# EAGLE design InputSwitch (EAGLE 6.1)
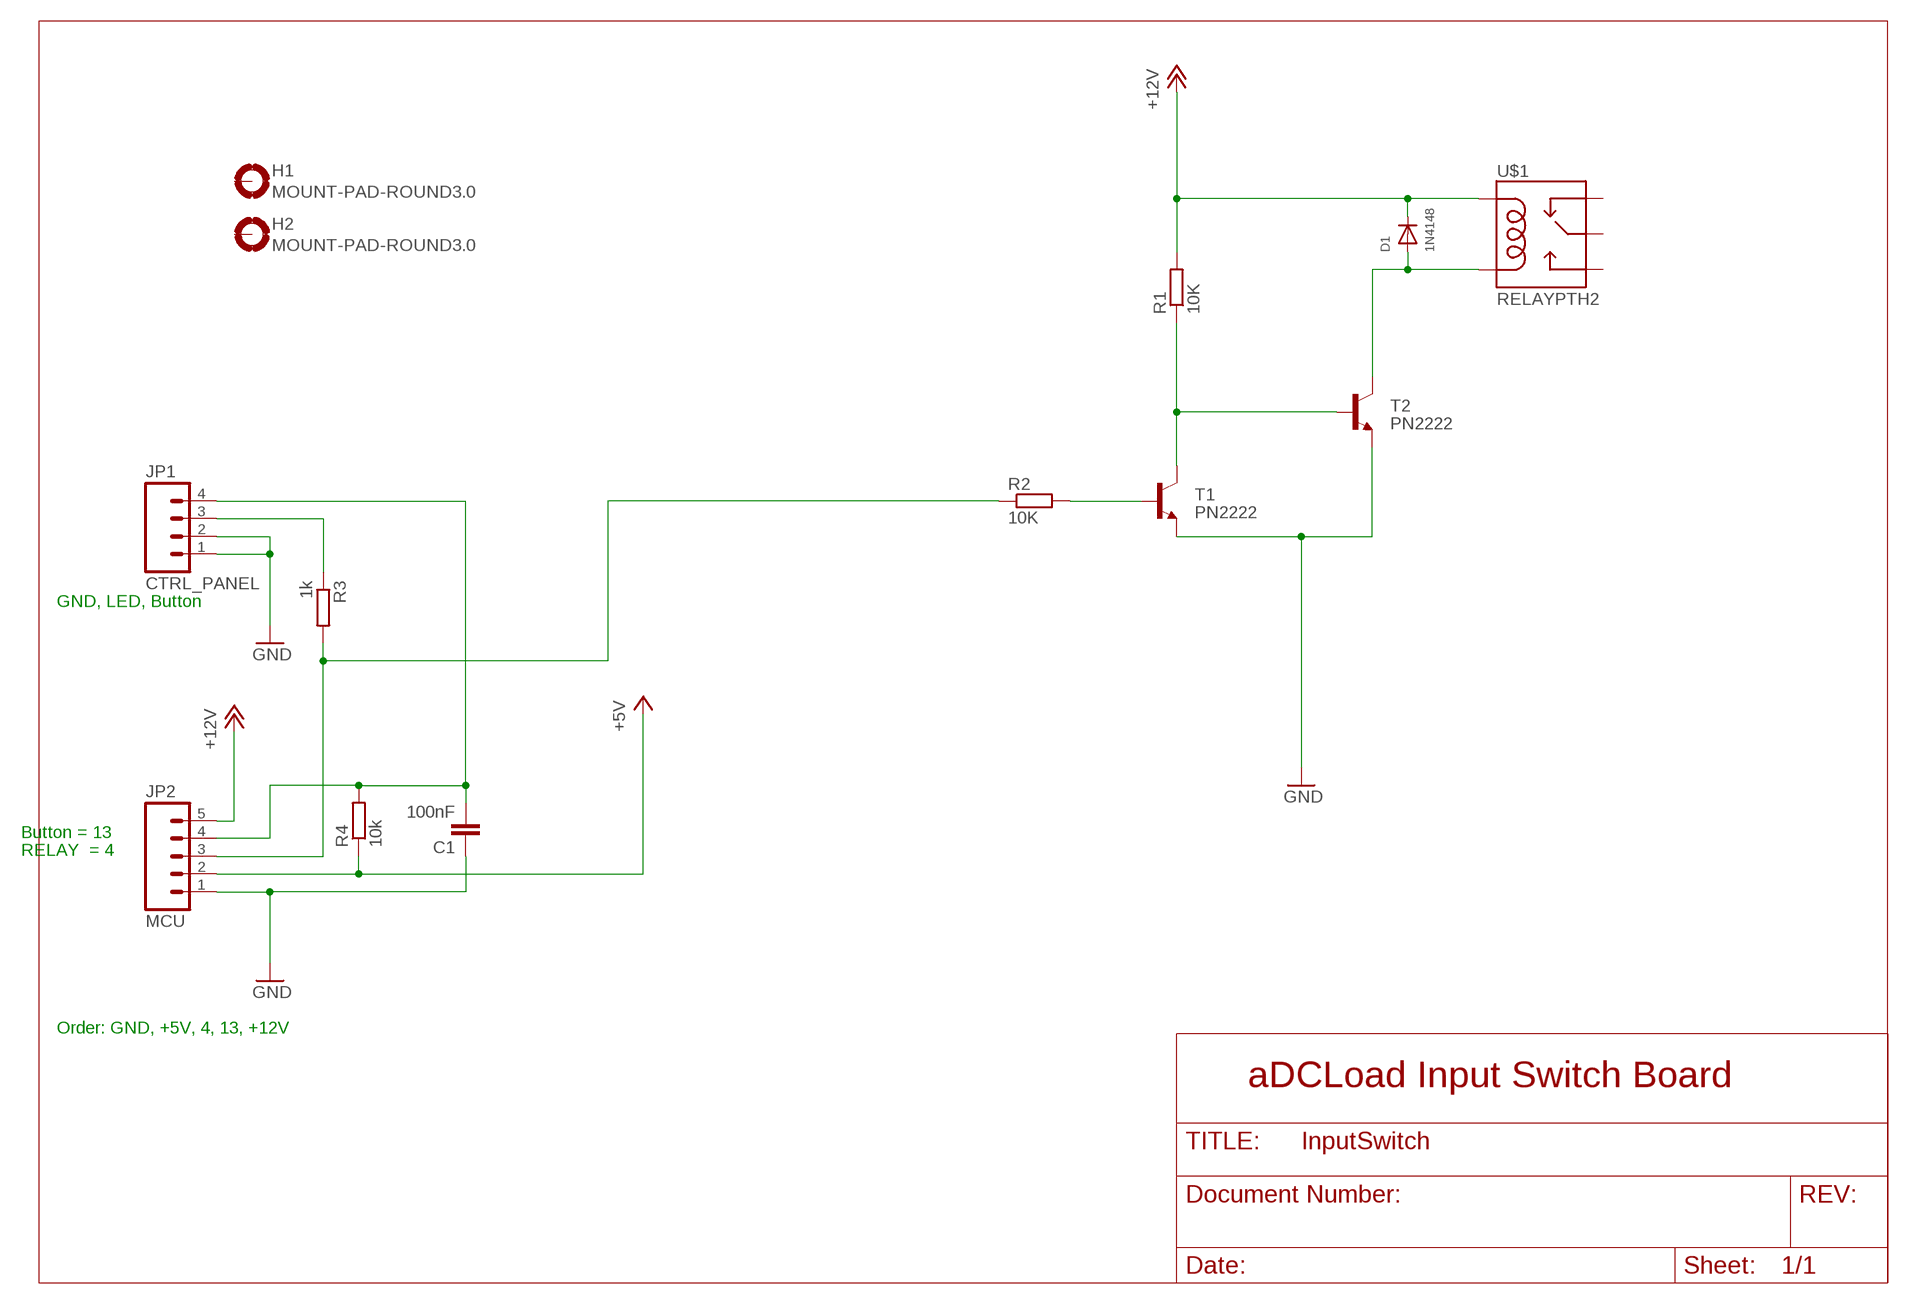
[diagram p0: schematic, sheet 1]

## Parts
C1  100nF  C-EUC0805  [C0805]
D1  1N4148  DIODESOD-123  [SOD-123]
H1  MOUNT-PAD-ROUND3.0  [3,0-PAD]
H2  MOUNT-PAD-ROUND3.0  [3,0-PAD]
JP1  CTRL_PANEL  M04PTH  [1X04]
JP2  MCU  M05PTH  [1X05]
R1  10K  R-EU_R0805  [R0805]
R2  10K  R-EU_R0805  [R0805]
R3  1k  R-EU_R0805  [R0805]
R4  10k  R-EU_R0805  [R0805]
T1  PN2222  TRANSISTOR_NPNMMBT2222A  [SOT23-3]
T2  PN2222  TRANSISTOR_NPNMMBT2222A  [SOT23-3]
U$1  RELAYPTH2  [RELAY-T9A]

## Nets
+5V: JP2.2 R4.1
+12V: D1.C JP2.5 R1.2 U$1.COIL1
BTN: C1.2 JP1.4 JP2.4 R4.2
GND: C1.1 JP1.1 JP1.2 JP2.1 T1.2(E) T2.2(E)
N$1: R2.2 T1.1(B)
N$2: R1.1 T1.3(C) T2.1(B)
N$4: D1.A T2.3(C) U$1.COIL2
N$6: JP2.3 R2.1 R3.2
RL_LED: JP1.3 R3.1
Unconnected: H1.B3,0(MOUNT) H2.B3,0(MOUNT) U$1.MAIN U$1.NC U$1.NO

## Notes on the sheet
- GND, LED, Button
- Button = 13
- RELAY  = 4
- Order: GND, +5V, 4, 13, +12V
- aDCLoad Input Switch Board

## Library data of the parts
C1 = resistor:C-EU: CAPACITOR, European symbol
D1 = adafruit:DIODE: Diode SMADIODE - SMA Surface Mount Package 20V 1A Schottky Diode Digikey: 641-1014-6-ND DO-1N4148 - Through Hole Small Current Diode SOD-123 20V 1 A (.5mV Vf) Schottky Diode - Digikey: MBRX120TPMSCT-ND SOD-323 10V 570mA (.38mV Vf, 3ns) Schottky Diode - Digikey: ZLLS410CT-ND SOD-523 30V 30mA Schottky Diode (RB751S-40TE61) - Digikey: RB751S-40TE61CT-ND SOT23-R/W - SOT23 Package (R = Solder Paste/Reflow Ovens, W = Hand-Soldering) BAT54Film 40V 300mA - Digikey: 497-7162-1-ND
H1 H2 = holes:MOUNT-PAD-ROUND: MOUNTING PAD, round
JP1 = SparkFun-Connectors:M04: Header 4 Standard 4-pin 0.1" header. Use with straight break away headers (SKU : PRT-00116), right angle break away headers (PRT-00553), swiss pins (PRT-00743), machine pins (PRT-00117), and female headers (PRT-00115). Molex polarized connector foot print use with SKU : PRT-08231 with associated crimp pins and housings. 1MM SMD Version SKU: PRT-10208
JP2 = SparkFun-Connectors:M05: Header 5 Standard 5-pin 0.1" header. Use with straight break away headers (SKU : PRT-00116), right angle break away headers (PRT-00553), swiss pins (PRT-00743), machine pins (PRT-00117), and female headers (PRT-00115). Molex polarized connector foot print use with SKU : PRT-08230 with associated crimp pins and housings.
R1-R4 = resistor:R-EU_: RESISTOR, European symbol
T1 T2 = SparkFun-DiscreteSemi:TRANSISTOR_NPN: Generic NPN BJT MMBT2222A - TRANS-08049 (SOT-23, 1A 40V) MPSA42 - TRANS-09116 (SOT-23, 500mA 300V) MMBT5088LT1G - TRANS-11160 (SOT-23, 50 mA 30V); PROD_ID: TRANS-08049; VALUE: MMBT2222A
U$1 = SparkFun-Electromechanical:RELAY: SPDT relay (COM-00101)

## Board
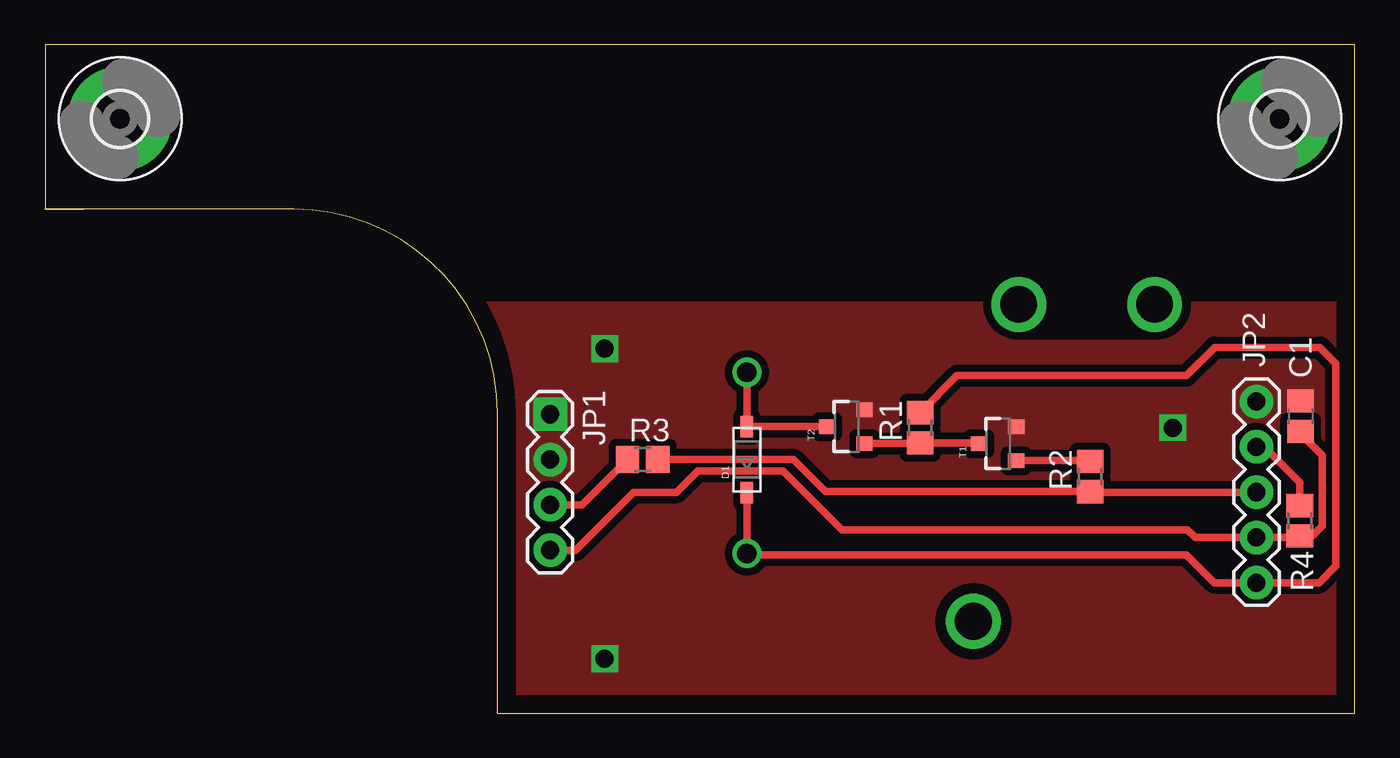
[diagram p1: board, top side]
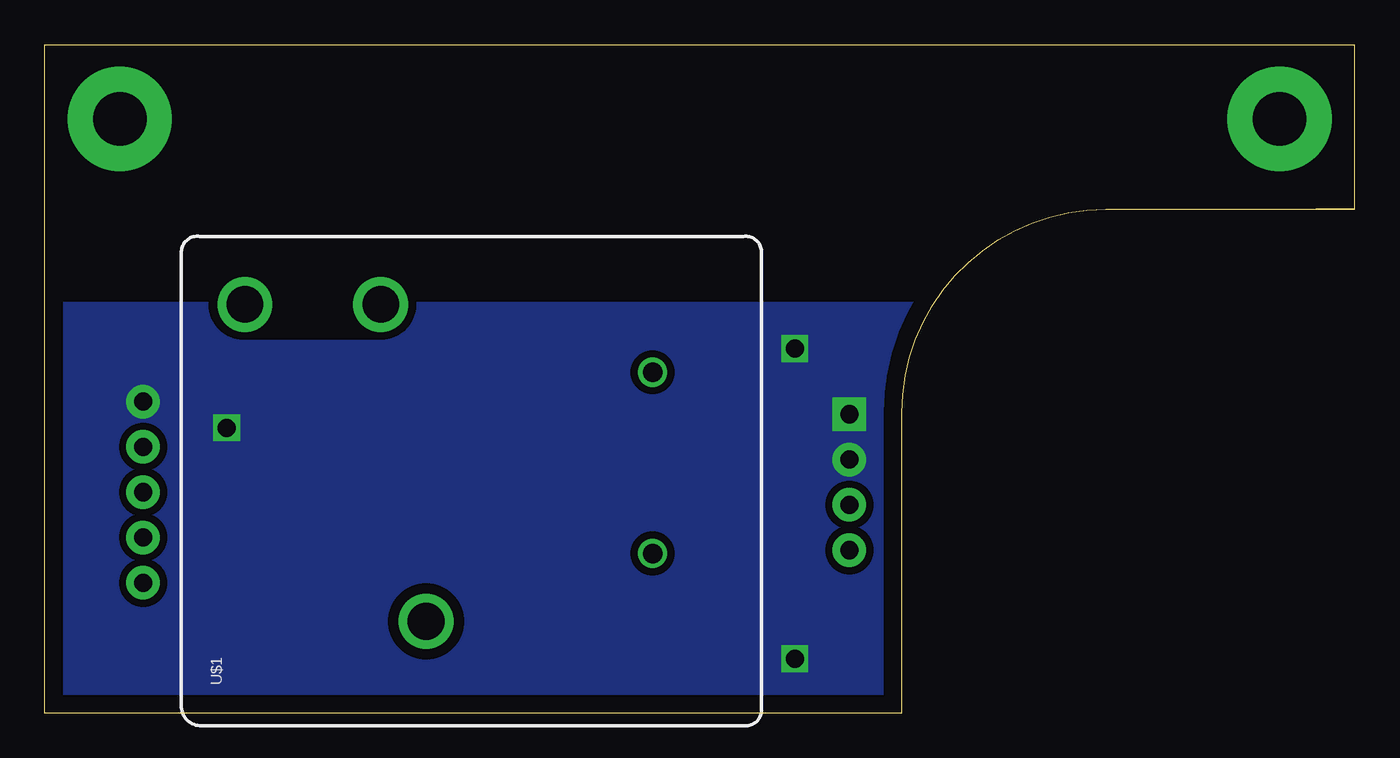
[diagram p2: board, bottom side, seen from below]

Size 73.46 x 37.49 mm. Coordinates in mm from the lower left corner, seen from the top.
Outline: 0,28.26 13.97,28.26 arc-90 25.4,16.83 25.4,0 73.46,0 73.46,37.49 0.02,37.49 0.02,28.26 2.19,28.26
Copper layers (1*16): Top 0.035mm / dielectric 1.5mm / Bottom 0.035mm
Design rules: minimum track width 10mil, minimum drill 24mil, track to track 8mil, track to pad 8mil, pad to pad 8mil, via to via 8mil, smd to smd 8mil, copper to edge 40mil, drill to drill 8mil, minimum pad ring 10mil, minimum via ring 8mil, stop-mask expansion 4mil, vias tented up to drill 0mil, thermal gap 10mil
tRestrict: area 0,23.5 to 73.5,37.5; area 50.3,3.4 to 53.8,6.9; area 53,21.3 to 63.9,23.5
bRestrict: area 0,23.5 to 73.4,37.5; area 50.3,3.4 to 53.8,6.9; area 53,21.3 to 63.9,23.5

### Footprints (pad centres in the part's own frame; a part is rotated, then mirrored left to right if it is on the bottom)
C0805 = smd 1.3 x 1.5: 1 -0.85,0; 2 0.85,0
SOD-123 = smd 1.2 x 0.7: A 1.85,0; C -1.85,0
3,0-PAD = drill 3 pad 5.842: B3,0 0,0
1X04 = drill 1.016 pad 1.88 square: 1 0,0 | drill 1.016 pad 1.88: 2 2.54,0; 3 5.08,0; 4 7.62,0
1X05 = drill 1.016 pad 1.88: 1 0,0; 2 2.54,0; 3 5.08,0; 4 7.62,0; 5 10.16,0
R0805 = smd 1.3 x 1.5: 1 -0.85,0; 2 0.85,0
SOT23-3 = smd 0.8 x 0.9: 1 -0.95,-1; 2 0.95,-1; 3 0,1.1
RELAY-T9A = drill 1.092: COIL1 -4.064,-10.16; COIL2 6.096,-10.16 | drill 2.057: MAIN -7.874,2.54; NC 9.906,12.7; NO 9.906,5.08

### Placement (x,y rotation side)
C1  70.41,16.65 270 top
D1  39.37,14.23 90 top
H1  4.23,33.33 0 top
H2  69.24,33.33 0 top
JP1  28.34,16.76 270 top
JP2  67.94,17.47 270 top
R1  49.09,16 90 top
R2  58.61,13.27 90 top
R3  33.53,14.23 0 top
R4  70.37,10.79 270 top
T1  53.47,15.11 90 top
T2  44.96,16.07 90 top
U$1  49.53,13.02 90 bottom

### Tracks (layer width: path | path; a pad name or v marks a point on that pad's centre or on a via)
+5V
  Top 0.406: R4.1 70.37,12.95 68.38,14.93 JP2.2
+12V
  Top 0.406: R1.2 51.16,18.92 64.01,18.92 65.6,20.51 71.5,20.51 72.39,19.62 72.39,8.26 71.45,7.31 JP2.5 65.59,7.31 64.01,8.89 39.37,8.89 D1.C U$1.COIL1
BTN
  Top 0.406: 67.93,9.84 JP2.4 | JP2.4 70.29,9.85 R4.2 71.07,9.94 71.63,10.5 71.63,14.46 70.41,15.68 C1.2 | JP1.4 29.78,9.14 33.02,12.38 35.43,12.38 36.64,13.59 41.4,13.59 44.7,10.29 64.07,10.29 64.51,9.85 JP2.4
GND  (via drill 1)
  other vias: 31.4,20.45 31.4,3.05 63.25,16
  pour Top (isolate 0.406, no thermals): 22.86,24.45 22.76,-0.98 74.83,-0.98 74.93,24.45
  pour Bottom (isolate 0.406, no thermals): 22.86,24.45 22.8,-0.98 73.6,-0.98 73.66,24.45
N$1
  Top 0.406: T1.1 58.57,14.17 R2.2
N$2
  Top 0.406: T2.1 49.05,15.12 R1.1 52.33,15.15 T1.3
N$4
  Top 0.406: U$1.COIL2 D1.A T2.3
N$6
  Top 0.406: R3.2 41.97,14.23 43.78,12.42 R2.1 58.64,12.39 JP2.3
RL_LED
  Top 0.406: JP1.3 30.14,11.68 R3.1

### Text on the board
tDocu: GND | GND | GND | +5V | Relay | LED | Button | Button | +12V